# Altium schematic sheet EP-GUIDE-Board.SchDoc
size A4
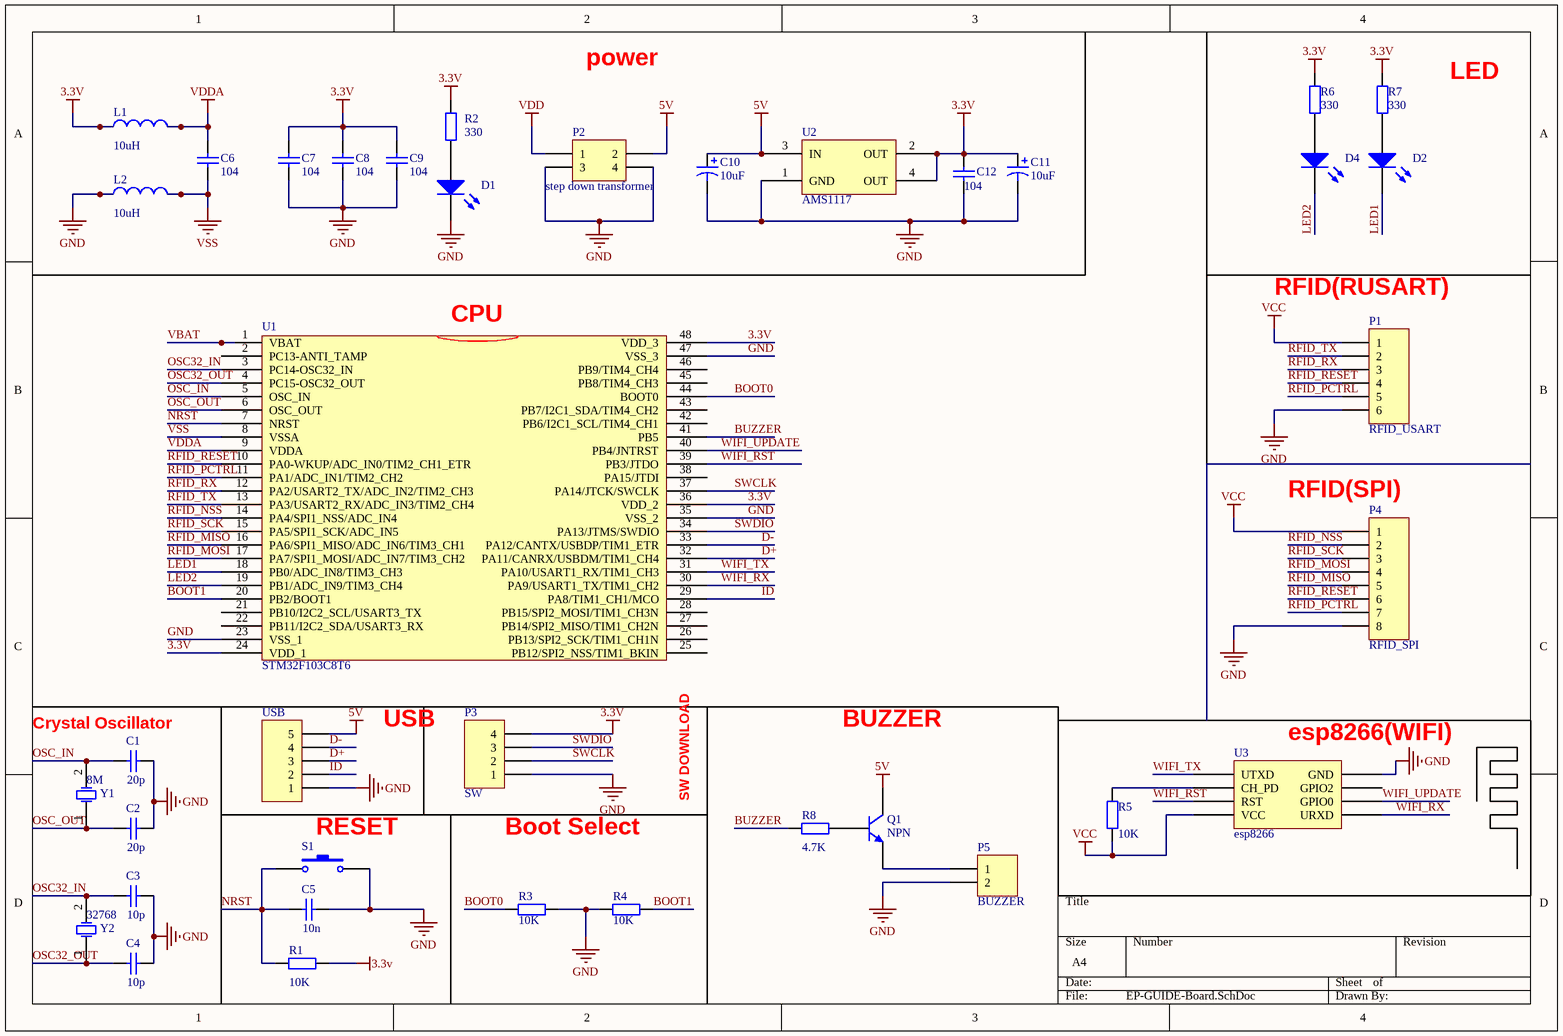
[diagram p0: EP-GUIDE-Board.SchDoc]

## Parts
C1  value 20p  [RAD-0.3]  (hidden comment: Cap)
C2  value 20p  [RAD-0.3]  (hidden comment: Cap)
C3  value 10p  [RAD-0.3]  (hidden comment: Cap)
C4  value 10p  [RAD-0.3]  (hidden comment: Cap)
C5  value 10n  [RAD-0.3]  (hidden comment: Cap)
C6  value 104  [RAD-0.3]  (hidden comment: Cap)
C7  value 104  [RAD-0.3]  (hidden comment: Cap)
C8  value 104  [RAD-0.3]  (hidden comment: Cap)
C9  value 104  [RAD-0.3]  (hidden comment: Cap)
C10  value 10uF  [C0805]  (hidden comment: Cap Pol3)
C11  value 10uF  [C0805]  (hidden comment: Cap Pol3)
C12  value 104  [RAD-0.3]  (hidden comment: Cap)
D1  LED3  [3.5X2.8X1.9]  (value not drawn)
D2  LED3  [3.5X2.8X1.9]  (value not drawn)
D4  LED3  [3.5X2.8X1.9]  (value not drawn)
L1  value 10uH  [0402-A]  (hidden comment: Inductor)
L2  value 10uH  [0402-A]  (hidden comment: Inductor)
P1  RFID_USART  [HDR1X6]
P2  step down transformer  [HDR2X2]
P3  SW  [HDR1X4]
P4  RFID_SPI  [HDR1X8]
P5  BUZZER  [HDR1X2]
Q1  NPN  [TO-226-AA]
R1  value 10K  [AXIAL-0.4]  (hidden comment: Res2)
R2  value 330  [AXIAL-0.4]  (hidden comment: Res2)
R3  value 10K  [AXIAL-0.4]  (hidden comment: Res2)
R4  value 10K  [AXIAL-0.4]  (hidden comment: Res2)
R5  value 10K  [AXIAL-0.4]  (hidden comment: Res2)
R6  value 330  [AXIAL-0.4]  (hidden comment: Res2)
R7  value 330  [AXIAL-0.4]  (hidden comment: Res2)
R8  value 4.7K  [AXIAL-0.4]  (hidden comment: Res2)
S1  SW-PB  [SPST-2]  (value not drawn)
U1  STM32F103C8T6  [LQFP48S]
U2  AMS1117  [SOT-223]
U3  esp8266
USB  USB  [Micro_USB]  (value not drawn)
Y1  8M  [R38]
Y2  32768  [R38]

## Blocks framed on the sheet
esp8266(WIFI): R5 U3

## Nets
3.3V: C7.1 C8.1 C9.1 C11.1 C12.1 L1.1 P3.4 R1.2 R2.2 R6.2 R7.2 U1.24(VDD_1) U1.36(VDD_2) U1.48(VDD_3) U2.2(OUT) U2.4(OUT)
5V: C10.1 P2.2 Q1.1(C) U2.3(IN) USB.5
GND: C1.2 C2.2 C3.2 C4.2 C5.2 C7.2 C8.2 C9.2 C10.2 C11.2 C12.2 D1.2(K) L2.1 P1.6 P2.3 P2.4 P3.1 P4.8 P5.2 R3.2 R4.1 S1.2 U1.23(VSS_1) U1.35(VSS_2) U1.47(VSS_3) U2.1(GND) U3.?5(GND) USB.1
VCC: P1.1 P4.1 R5.1 U3.?4(VCC)
VDD: P2.1
VDDA: C6.2 L1.2 U1.9(VDDA)
VSS: C6.1 L2.2 U1.8(VSSA)
BOOT0: R3.1 U1.44(BOOT0)
BOOT1: R4.2 U1.20(PB2/BOOT1)
BUZZER: R8.1 U1.41(PB5)
D+: U1.32(PA11/CANRX/USBDM/TIM1_CH4) USB.3
D-: U1.33(PA12/CANTX/USBDP/TIM1_ETR) USB.4
ID: U1.29(PA8/TIM1_CH1/MCO) USB.2
LED1: D2.2(K) U1.18(PB0/ADC_IN8/TIM3_CH3)
LED2: D4.2(K) U1.19(PB1/ADC_IN9/TIM3_CH4)
NRST: C5.1 R1.1 S1.1 U1.7(NRST)
OSC32_IN: C3.1 U1.3(PC14-OSC32_IN) Y2.2(OSC2)
OSC32_OUT: C4.1 U1.4(PC15-OSC32_OUT) Y2.1(OSC1)
OSC_IN: C1.1 U1.5(OSC_IN) Y1.2(OSC2)
OSC_OUT: C2.1 U1.6(OSC_OUT) Y1.1(OSC1)
RFID_MISO: P4.5 U1.16(PA6/SPI1_MISO/ADC_IN6/TIM3_CH1)
RFID_MOSI: P4.4 U1.17(PA7/SPI1_MOSI/ADC_IN7/TIM3_CH2)
RFID_NSS: P4.2 U1.14(PA4/SPI1_NSS/ADC_IN4)
RFID_PCTRL: P1.5 P4.7 U1.11(PA1/ADC_IN1/TIM2_CH2)
RFID_RESET: P1.4 P4.6 U1.10(PA0-WKUP/ADC_IN0/TIM2_CH1_ETR)
RFID_RX: P1.3 U1.12(PA2/USART2_TX/ADC_IN2/TIM2_CH3)
RFID_SCK: P4.3 U1.15(PA5/SPI1_SCK/ADC_IN5)
RFID_TX: P1.2 U1.13(PA3/USART2_RX/ADC_IN3/TIM2_CH4)
SWCLK: P3.2 U1.37(PA14/JTCK/SWCLK)
SWDIO: P3.3 U1.34(PA13/JTMS/SWDIO)
VBAT: U1.1(VBAT)
WIFI_RST: U1.39(PB3/JTDO) U3.?3(RST)
WIFI_RX: U1.30(PA9/USART1_TX/TIM1_CH2) U3.?8(URXD)
WIFI_TX: U1.31(PA10/USART1_RX/TIM1_CH3) U3.?1(UTXD)
WIFI_UPDATE: U1.40(PB4/JNTRST) U3.?7(GPIO0)
NetD1_1: D1.1(A) R2.1
NetD2_1: D2.1(A) R7.1
NetD4_1: D4.1(A) R6.1
NetP5_1: P5.1 Q1.3(E)
NetQ1_2: Q1.2(B) R8.2
NetR5_2: R5.2 U3.?2(CH_PD)

Not connected (* = marked no-connect by the designer): U1 2(PC13-ANTI_TAMP) 21(PB10/I2C2_SCL/USART3_TX) 22(PB11/I2C2_SDA/USART3_RX) 25(PB12/SPI2_NSS/TIM1_BKIN) 26(PB13/SPI2_SCK/TIM1_CH1N) 27(PB14/SPI2_MISO/TIM1_CH2N) 28(PB15/SPI2_MOSI/TIM1_CH3N) 38(PA15/JTDI) 42(PB6/I2C1_SCL/TIM4_CH1) 43(PB7/I2C1_SDA/TIM4_CH2) 45(PB8/TIM4_CH3) 46(PB9/TIM4_CH4); U3 ?6(GPIO2)

## Notes on the sheet
- power
- LED
- (near P1) RFID(RUSART)
- (near U1) CPU
- (near P4) RFID(SPI)
- (near C1) Crystal Oscillator
- USB
- BUZZER
- RESET
- (near P3) Boot Select
- SW DOWNLOAD

## Library data of the parts
C1-C9 C12 = Cap: Capacitor; Published: 8-Jun-2000; LatestRevisionDate: 17-Jul-2002; LatestRevisionNote: Re-released for DXP Platform.; PackageReference: RAD-0.3; Publisher: Altium Limited; PackageDescription: Radial Cap, Thru-Hole; 2 Leads; 0.3 in Pin Spacing
C10 C11 = Cap Pol3: Polarized Capacitor (Surface Mount); Published: 8-Jun-2000; LatestRevisionDate: 29-May-2009; LatestRevisionNote: IPC-7351 Footprint Added.; PackageReference: C0805; Publisher: Altium Limited; PackageDescription: Chip Capacitor
D1 D2 D4 = LED3: Typical BLUE SiC LED; Published: 8-Jun-2000; LatestRevisionDate: 17-Dec-2003; LatestRevisionNote: PCB Footprint replaced.; DatasheetVersion: 16-Apr-2002; PackageVersion: 16-Apr-2002; PackageReference: 3.5X2.8X1.9; Publisher: Altium Limited; PackageDescription: SM LED; 2 C-Bend Leads; Body 3.5 x 2.8 x 1.9 mm, inc leads (LxWxH typ)
L1 L2 = Inductor: Code_IEC: 1005; Published: 8-Jun-2000; LatestRevisionDate: 29-May-2009; LatestRevisionNote: IPC-7351 Footprint Added.; PackageReference: 0402-A; Publisher: Altium Limited; PackageDescription: Chip Inductor; Code_JEITA: 0402
P1 = Header 6: Header, 6-Pin; LatestRevisionDate: 17-Jul-2002; LatestRevisionNote: Re-released for DXP Platform.; Publisher: Altium Limited
P2 = Header 2X2: Header, 2-Pin, Dual row; LatestRevisionDate: 17-Jul-2002; LatestRevisionNote: Re-released for DXP Platform.; Publisher: Altium Limited
P3 = Header 4: Header, 4-Pin; LatestRevisionDate: 17-Jul-2002; LatestRevisionNote: Re-released for DXP Platform.; Publisher: Altium Limited
P4 = Header 8: Header, 8-Pin; LatestRevisionDate: 17-Jul-2002; LatestRevisionNote: Re-released for DXP Platform.; Publisher: Altium Limited
P5 = Header 2: Header, 2-Pin; LatestRevisionDate: 17-Jul-2002; LatestRevisionNote: Re-released for DXP Platform.; Publisher: Altium Limited
Q1 = NPN: NPN Bipolar Transistor; Published: 8-Jun-2000; LatestRevisionDate: 17-Jul-2002; LatestRevisionNote: Re-released for DXP Platform.; PackageReference: TO-226-AA; Publisher: Altium Limited; PackageDescription: TO, Flat Index; 3 In-Line, Axial Leads; Body Dia. 4.8mm; Leads 0.55 x 0.51 mm (max); Code_JEDEC: TO-226-AA
R1-R8 = Res2: Resistor; Published: 8-Jun-2000; LatestRevisionDate: 17-Jul-2002; LatestRevisionNote: Re-released for DXP Platform.; PackageReference: AXIAL-0.4; Publisher: Altium Limited; PackageDescription: Axial Device, Thru-Hole; 2 Leads; 0.4 in Pin Spacing
S1 = SW-PB: Switch; Published: 24-Mar-1999; LatestRevisionDate: 17-Jul-2002; LatestRevisionNote: Re-released for DXP Platform.; PackageReference: SPST-2; Publisher: Altium Limited; PackageDescription: Switch; 2 Leads
U1 = STM32F103C6
USB = Header 5: Header, 5-Pin; LatestRevisionDate: 17-Jul-2002; LatestRevisionNote: Re-released for DXP Platform.; Publisher: Altium Limited
Y1 Y2 = XTAL: Crystal Oscillator; Published: 8-Jun-2000; LatestRevisionDate: 17-Jul-2002; LatestRevisionNote: Re-released for DXP Platform.; PackageReference: R38; Publisher: Altium Limited; PackageDescription: Crystal, Thru-Hole; 2 Leads; Body 3.1 x 8.2 mm (Dia.xH)